# EAGLE schematic EARS (EAGLE 9.5.1)
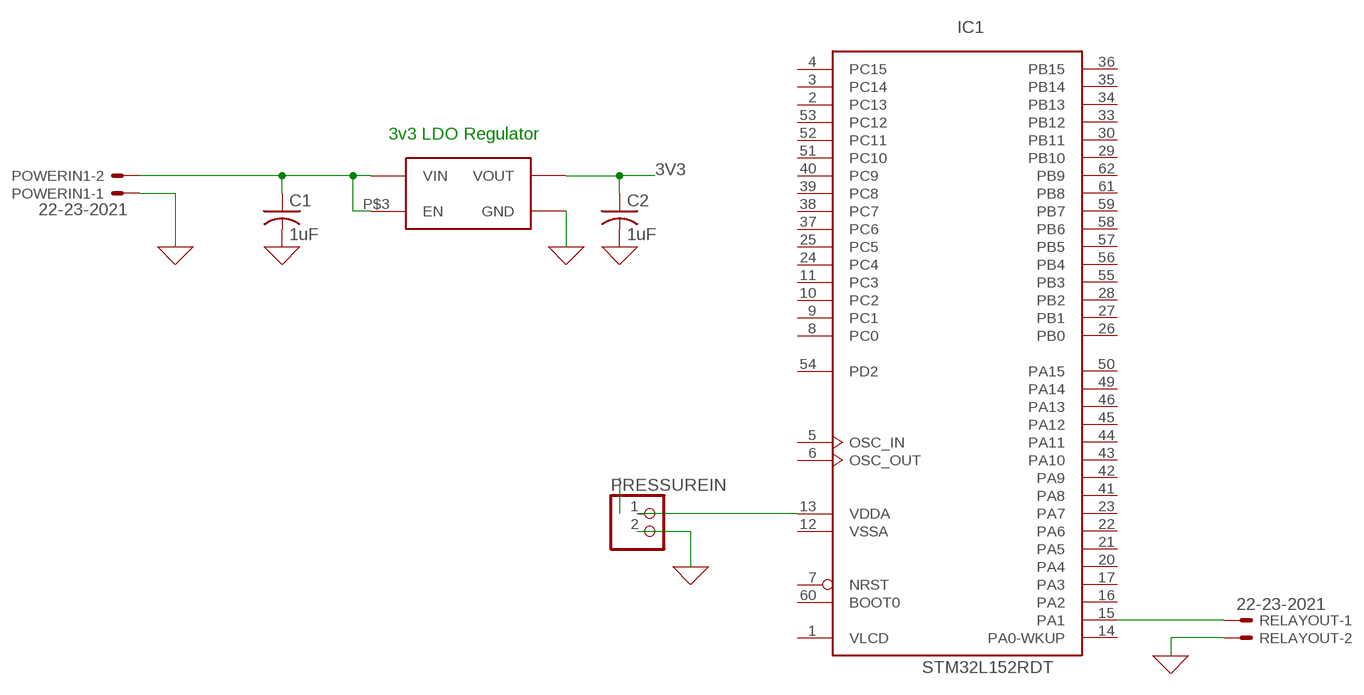
[diagram p0: schematic, sheet 1]

## Parts
3V3REG  NCP551  [5-TSOP]
C1  1uF  C-USC0603  [C0603]
C2  1uF  C-USC0603  [C0603]
IC1  STM32L152RDT  [LQFP64]
POWERIN1  22-23-2021  [22-23-2021]
PRESSUREIN  PINHD-1X2  [1X02]
RELAYOUT  22-23-2021  [22-23-2021]

## Nets
0: 3V3REG.P$1(GND) C1.2 C2.2 POWERIN1.1 PRESSUREIN.2 RELAYOUT.2 ; supply symbol labelled GND
3V3: 3V3REG.P$5(VOUT) C2.1
N$3: IC1.15(PA1) RELAYOUT.1
N$4: 3V3REG.P$2(VIN) 3V3REG.P$3(EN) C1.1 POWERIN1.2
N$5: IC1.13(VDDA) PRESSUREIN.1
Unconnected: IC1.2(PC13) IC1.3(PC14) IC1.4(PC15) IC1.5(OSC_IN) IC1.6(OSC_OUT) IC1.7(NRST) IC1.8(PC0) IC1.9(PC1) IC1.10(PC2) IC1.11(PC3) IC1.14(PA0-WKUP) IC1.16(PA2) IC1.17(PA3) IC1.20(PA4) IC1.21(PA5) IC1.22(PA6) IC1.23(PA7) IC1.24(PC4) IC1.25(PC5) IC1.26(PB0) IC1.27(PB1) IC1.28(PB2) IC1.29(PB10) IC1.30(PB11) IC1.33(PB12) IC1.34(PB13) IC1.35(PB14) IC1.36(PB15) IC1.37(PC6) IC1.38(PC7) IC1.39(PC8) IC1.40(PC9) IC1.41(PA8) IC1.42(PA9) IC1.43(PA10) IC1.44(PA11) IC1.45(PA12) IC1.46(PA13) IC1.49(PA14) IC1.50(PA15) IC1.51(PC10) IC1.52(PC11) IC1.53(PC12) IC1.54(PD2) IC1.55(PB3) IC1.56(PB4) IC1.57(PB5) IC1.58(PB6) IC1.59(PB7) IC1.60(BOOT0) IC1.61(PB8) IC1.62(PB9)

## Notes on the sheet
- 3v3 LDO Regulator

## Power pins joined to a net without a drawn wire
VDD: IC1.19(VDD) IC1.32(VDD) IC1.48(VDD) IC1.64(VDD)
VLCD: IC1.1(VLCD)
VSS: IC1.18(VSS) IC1.31(VSS) IC1.47(VSS) IC1.63(VSS)
VSSA: IC1.12(VSSA)

## Library data of the parts
3V3REG = EARS:NCP551
C1 C2 = rcl:C-US: CAPACITOR, American symbol; SPICEPREFIX: C
IC1 = micro-stm_v3:STM32L152R*T: ARM 32-bit Cortex™-M3 CPU 32 MHz maximum frequency 32 to 384 Kbytes of Flash memory 4 to 12 kbytes of SRAM 51 GPIOs 1.8 to 3.6 V application supply
POWERIN1 RELAYOUT = con-molex:22-23-2021: .100" (2.54mm) Center Header - 2 Pin; MF: MOLEX; MPN: 22-23-2021; OC_FARNELL: 1462926; OC_NEWARK: 25C3832
PRESSUREIN = pinhead:PINHD-1X2: PIN HEADER